# EAGLE schematic SAMD21-breakout v1 (EAGLE 7.7.0)
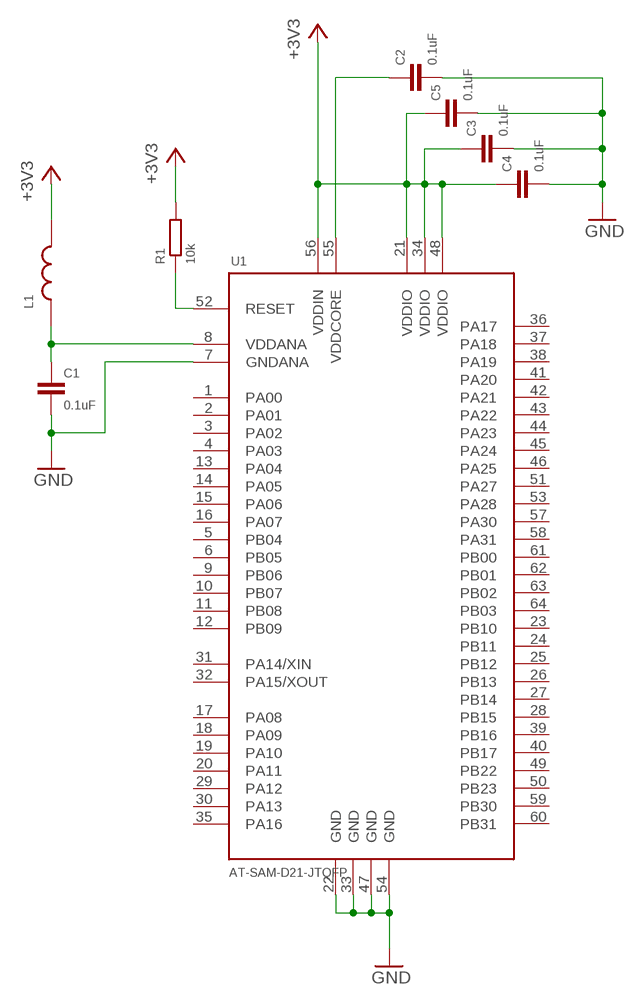
[diagram p0: schematic, sheet 1]

## Parts
C1  0.1uF  CAP0603  [CAP-0603]
C2  0.1uF  CAP0603  [CAP-0603]
C3  0.1uF  CAP0603  [CAP-0603]
C4  0.1uF  CAP0603  [CAP-0603]
C5  0.1uF  CAP0603  [CAP-0603]
L1  INDUCTOR0603  [IND-0603]
R1  10k  RESISTOR0603  [RES-0603]
U1  AT-SAM-D21-JTQFP  [TQFP-64]

## Nets
+3V3: C3.1 C4.1 C5.1 L1.2 R1.2 U1.21(VDDIO) U1.34(VDDIO) U1.48(VDDIO) U1.56(VDDIN)
GND: C1.2 C2.2 C3.2 C4.2 C5.2 U1.7(GNDANA) U1.22(GND) U1.33(GND) U1.47(GND) U1.54(GND)
N$1: C1.1 L1.1 U1.8(VDDANA)
N$2: R1.1 U1.52(RESET)
N$7: C2.1 U1.55(VDDCORE)
Unconnected: U1.1(PA00) U1.2(PA01) U1.3(PA02) U1.4(PA03) U1.5(PB04) U1.6(PB05) U1.9(PB06) U1.10(PB07) U1.11(PB08) U1.12(PB09) U1.13(PA04) U1.14(PA05) U1.15(PA06) U1.16(PA07) U1.17(PA08) U1.18(PA09) U1.19(PA10) U1.20(PA11) U1.23(PB10) U1.24(PB11) U1.25(PB12) U1.26(PB13) U1.27(PB14) U1.28(PB15) U1.29(PA12) U1.30(PA13) U1.31(PA14/XIN) U1.32(PA15/XOUT) U1.35(PA16) U1.36(PA17) U1.37(PA18) U1.38(PA19) U1.39(PB16) U1.40(PB17) U1.41(PA20) U1.42(PA21) U1.43(PA22) U1.44(PA23) U1.45(PA24) U1.46(PA25) U1.49(PB22) U1.50(PB23) U1.51(PA27) U1.53(PA28) U1.57(PA30) U1.58(PA31) U1.59(PB30) U1.60(PB31) U1.61(PB00) U1.62(PB01) U1.63(PB02) U1.64(PB03)

## Library data of the parts
C1-C5 = dr-library:CAP: Multilayer Ceramic Capacitor
L1 = dr-library:INDUCTOR
R1 = dr-library:RESISTOR
U1 = dr-library:AT-SAM-D21-J: Atmel/Microchip SAMD21 Series, 64-pin 32-bit ARM Cortex M0+